# Altium project pcb_iot.PrjPcb
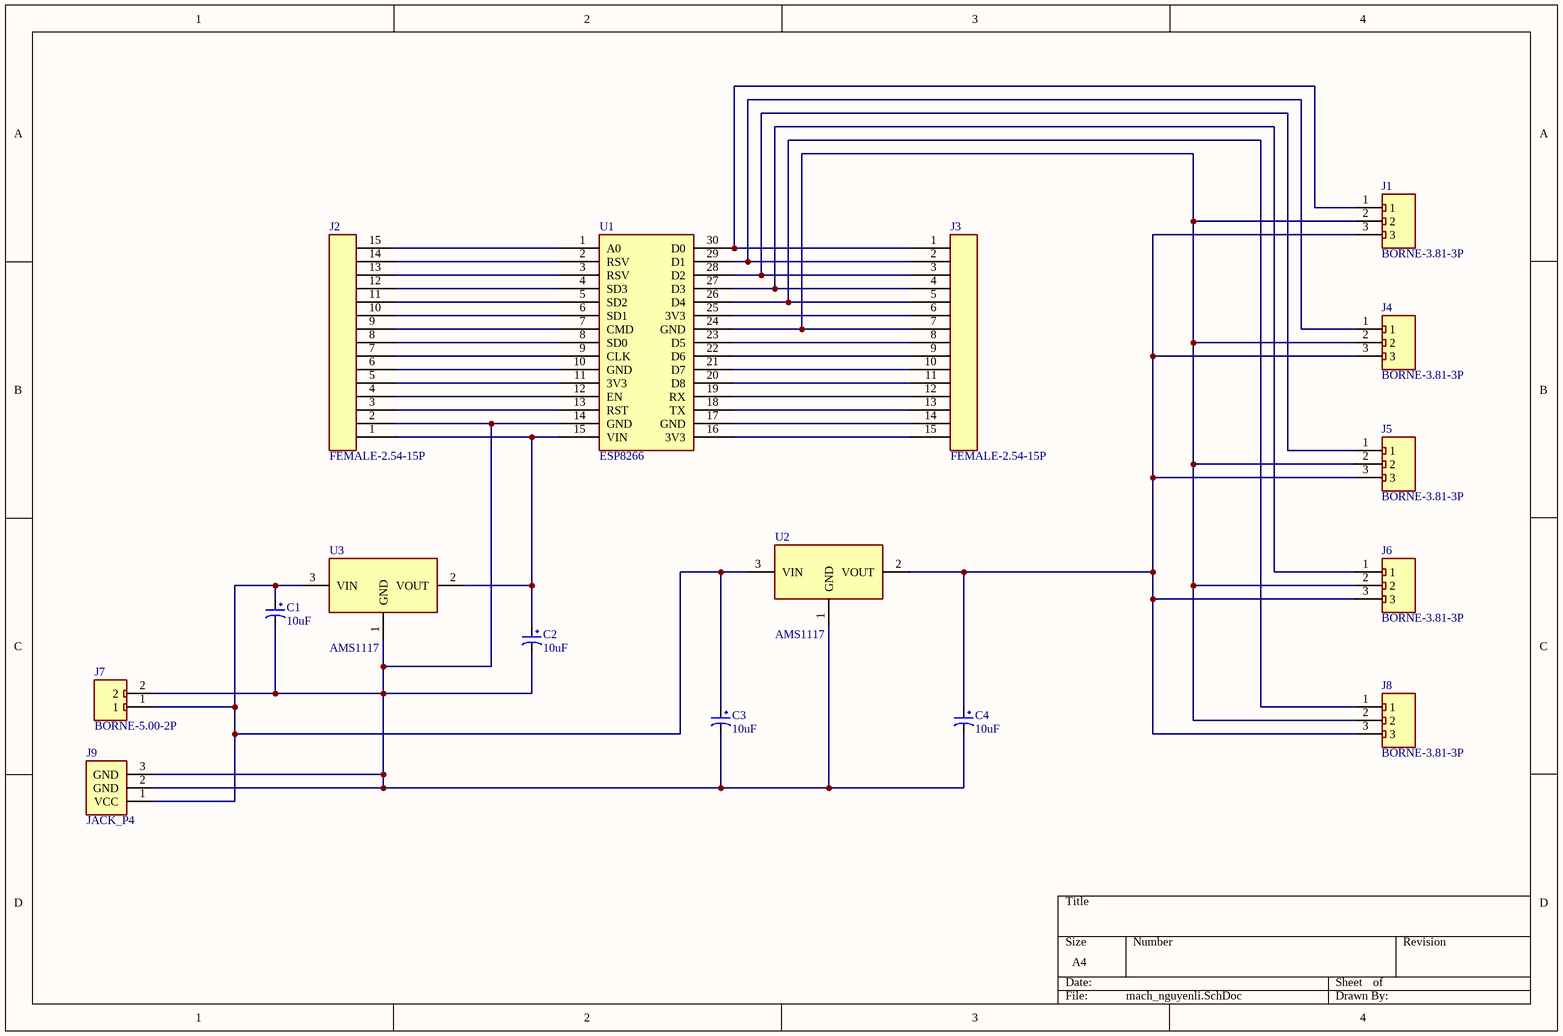
[diagram p0: mach_nguyenli.SchDoc]
1 sheet, 16 parts. Net scope: global (net labels, ports and power ports of the same name join across sheets).
Board file: pcb_final.PcbDoc

## Sheet mach_nguyenli.SchDoc
size A4; SheetNumber: 1; SheetTotal: 1

### Parts
C1  10uF  [CP1/2]
C2  10uF  [CP1/2]
C3  10uF  [CP1/2]
C4  10uF  [CP1/2]
J1  BORNE-3.81-3P  [BORNE-3.81-3P]
J2  FEMALE-2.54-15P  [FEMALE-2.54-15P]
J3  FEMALE-2.54-15P  [FEMALE-2.54-15P]
J4  BORNE-3.81-3P  [BORNE-3.81-3P]
J5  BORNE-3.81-3P  [BORNE-3.81-3P]
J6  BORNE-3.81-3P  [BORNE-3.81-3P]
J7  BORNE-5.00-2P  [BORNE-5.00-2P]
J8  BORNE-3.81-3P  [BORNE-3.81-3P]
J9  JACK_P4  [JACK_P4]
U1  ESP8266  [ESP8266]
U2  AMS1117  [AMS1117]
U3  AMS1117  [AMS1117]

### Nets
NetC1_1: C1.1 C3.1 J7.1 J9.1(VCC) U2.3(VIN) U3.3(VIN)
NetC1_2: C1.2 C2.2 C3.2 C4.2 J2.2 J7.2 J9.2(GND) J9.3(GND) U1.14(GND) U2.1(GND) U3.1(GND)
NetC2_1: C2.1 J2.1 U1.15(VIN) U3.2(VOUT)
NetC4_1: C4.1 J1.3 J4.3 J5.3 J6.3 J8.3 U2.2(VOUT)
NetJ1_1: J1.1 J3.1 U1.30(D0)
NetJ1_2: J1.2 J3.7 J4.2 J5.2 J6.2 J8.2 U1.24(GND)
NetJ2_3: J2.3 U1.13(RST)
NetJ2_4: J2.4 U1.12(EN)
NetJ2_5: J2.5 U1.11(3V3)
NetJ2_6: J2.6 U1.10(GND)
NetJ2_7: J2.7 U1.9(CLK)
NetJ2_8: J2.8 U1.8(SD0)
NetJ2_9: J2.9 U1.7(CMD)
NetJ2_10: J2.10 U1.6(SD1)
NetJ2_11: J2.11 U1.5(SD2)
NetJ2_12: J2.12 U1.4(SD3)
NetJ2_13: J2.13 U1.3(RSV)
NetJ2_14: J2.14 U1.2(RSV)
NetJ2_15: J2.15 U1.1(A0)
NetJ3_2: J3.2 J4.1 U1.29(D1)
NetJ3_3: J3.3 J5.1 U1.28(D2)
NetJ3_4: J3.4 J6.1 U1.27(D3)
NetJ3_5: J3.5 J8.1 U1.26(D4)
NetJ3_6: J3.6 U1.25(3V3)
NetJ3_8: J3.8 U1.23(D5)
NetJ3_9: J3.9 U1.22(D6)
NetJ3_10: J3.10 U1.21(D7)
NetJ3_11: J3.11 U1.20(D8)
NetJ3_12: J3.12 U1.19(RX)
NetJ3_13: J3.13 U1.18(TX)
NetJ3_14: J3.14 U1.17(GND)
NetJ3_15: J3.15 U1.16(3V3)

### Library data of the parts
C1-C4 = CP1: Cap P  0,1uF < 22uF , 16 - 50V; Value: 10uF/50V; Description 1: 10 => 220uF/6,3V/10V - 10uF => 100uF/16V; Description 2: 0,1uF => 33uF/50V - 10uF => 22uF/63V; Description 3: 0,47uF => 10uF/100V
J1 J4-J6 J8 = BORNE-3.81-3P: Borne 3 Vias, Pitch 3.81mm.
J2 J3 = FEMALE-2.54-15P: Female Header Connector 2.54mm 15 Pins.; JLCPCB PN: C2897378
J7 = BORNE-5.00-2P: Borne 2 Vias, Pitch 5mm.; JLCPCB PN: C91153
J9 = JACK_P4: 9V Battery Connector Jack P4.
U1 = ESP8266: Microcontoller Board 30 Pins Wifi 2.4GHz BLE 4.2 ESP-12F; ComponentLink1Description: Datasheet; ComponentLink1URL: https://docs.ai-thinker.com/_media/esp8266/docs/esp-12f_product_specification_en.pdf
U2 U3 = AMS1117: IC REG LINEAR 1A SOT-89-3L; ComponentLink1Description: Datasheet; ComponentLink1URL: http://www.advanced-monolithic.com/pdf/ds1117.pdf; Digikey PN: 4518-AMS1117-3.3CT-ND; JLCPCB PN: C963410